# EAGLE design satshakit-M7 (EAGLE 8.4.3)
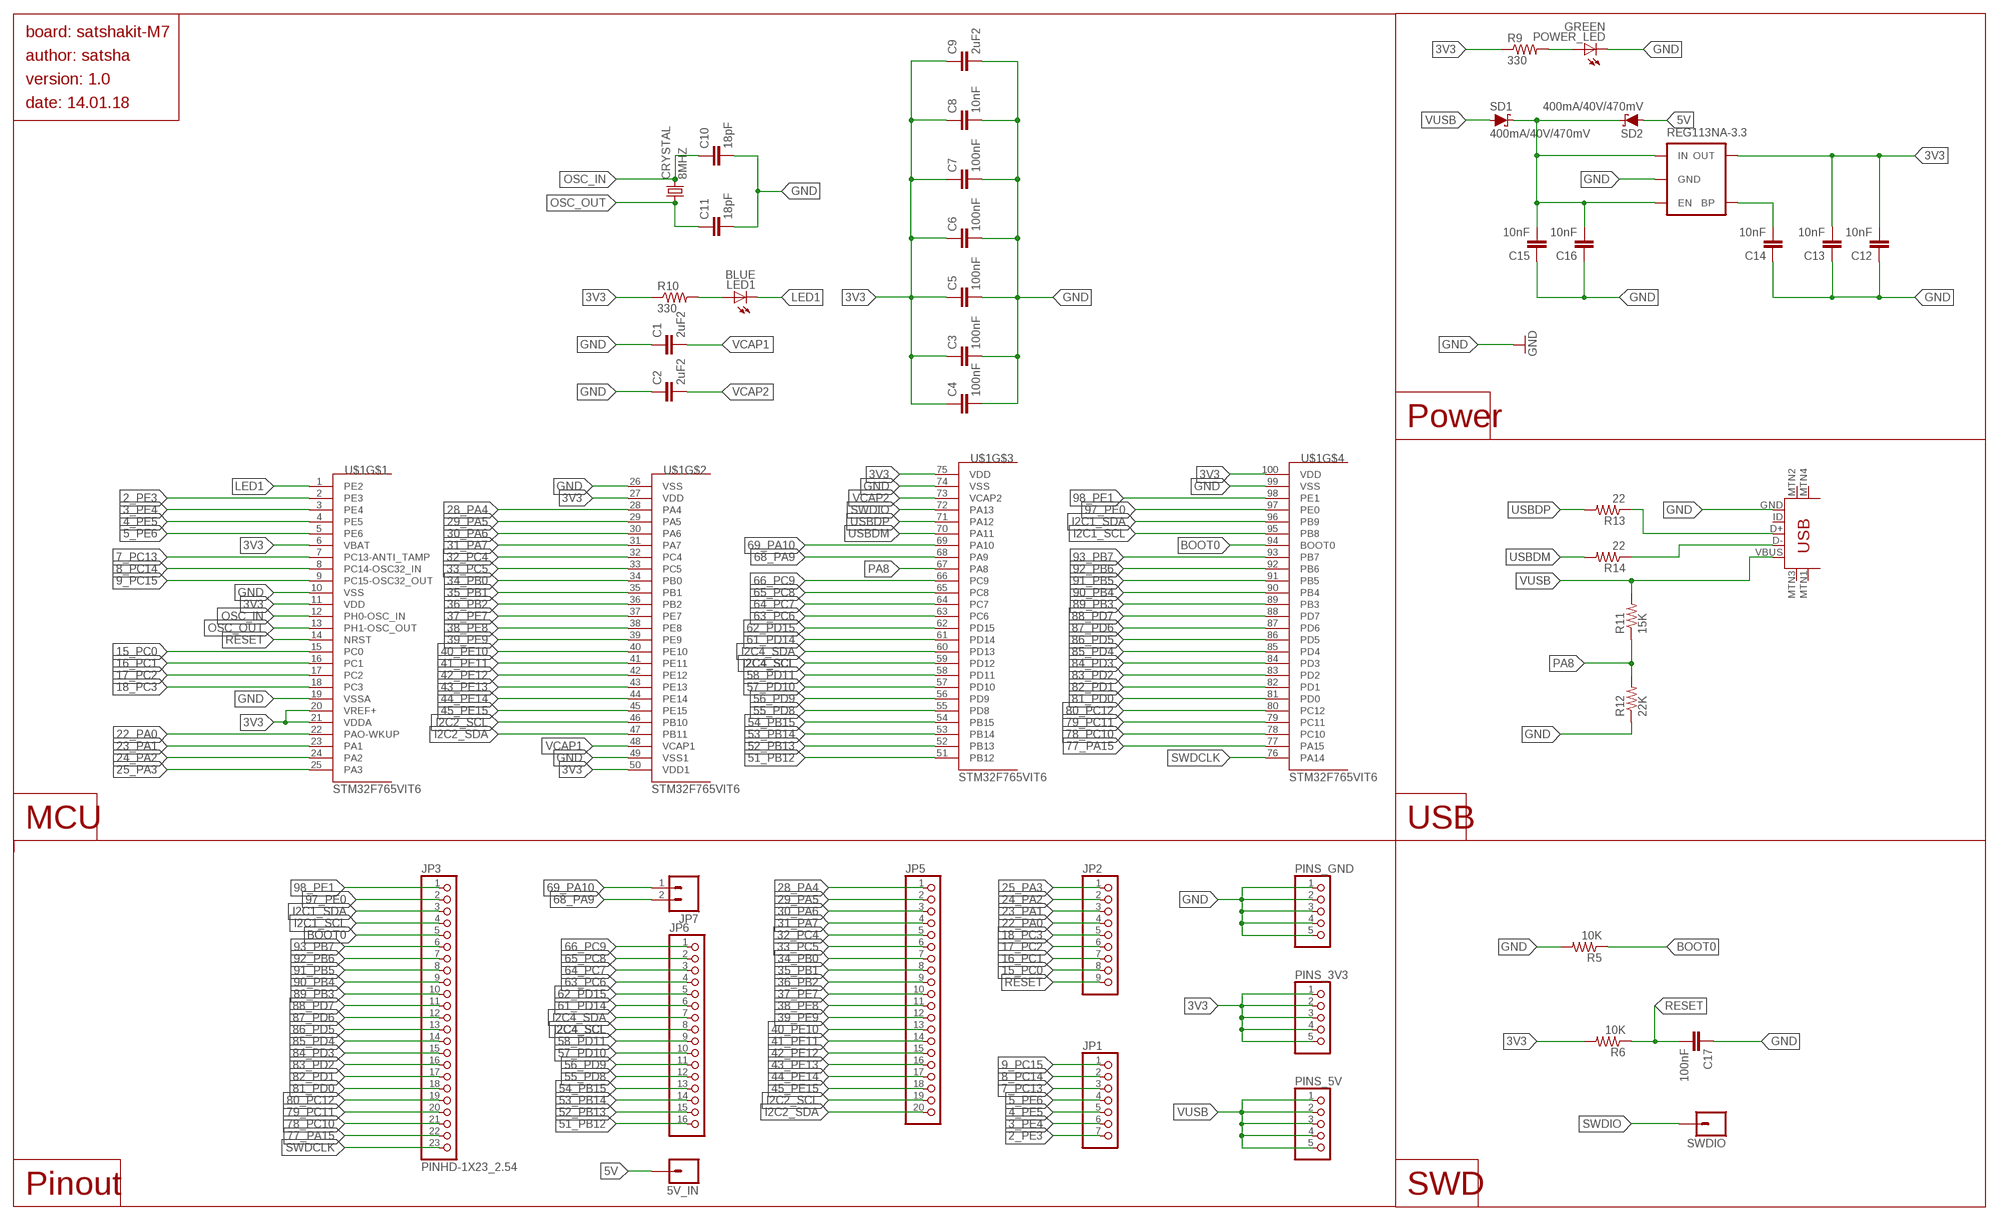
[diagram p0: schematic, sheet 1]

## Parts
5V_IN  M01PTH_LONGPAD  [1X01_LONGPAD]
C1  2uF2  CAP1206  [1206]
C2  2uF2  CAP1206  [1206]
C3  100nF  CAP1206  [1206]
C4  100nF  CAP1206  [1206]
C5  100nF  CAP1206  [1206]
C6  100nF  CAP1206  [1206]
C7  100nF  CAP1206  [1206]
C8  10nF  CAP1206  [1206]
C9  2uF2  CAP1206  [1206]
C10  18pF  CAP1206  [1206]
C11  18pF  CAP1206  [1206]
C12  10nF  CAP1206  [1206]
C13  10nF  CAP1206  [1206]
C14  10nF  CAP1206  [1206]
C15  10nF  CAP1206  [1206]
C16  10nF  CAP1206  [1206]
C17  100nF  CAP1206  [1206]
CRYSTAL  8MHZ  CSM-7X-DU  [CSM-7X-DU]
JP1  PINHD-1X07_2.54  [1X07]
JP2  PINHD-1X09_2.54  [1X09]
JP3  PINHD-1X23_2.54  [1X23]
JP5  PINHD-1X20_2.54  [1X20]
JP6  PINHD-1X16_2.54  [1X16]
JP7  M02  [1X02_LONGPADS]
LED1  BLUE  LED1206  [1206]
PINS_3V3  PINHD-1X05_2.54  [1X05]
PINS_5V  PINHD-1X05_2.54  [1X05]
PINS_GND  PINHD-1X05_2.54  [1X05]
POWER_LED  GREEN  LED1206  [1206]
R5  10K  RESISTOR1206  [1206]
R6  10K  RESISTOR1206  [1206]
R9  330  RESISTOR1206  [1206]
R10  330  RESISTOR1206  [1206]
R11  15K  RESISTOR1206  [1206]
R12  22K  RESISTOR1206  [1206]
R13  22  RESISTOR1206  [1206]
R14  22  RESISTOR1206  [1206]
REG113NA-3.3  V_REG_LDOSMD  [SOT23-5]
SD1  400mA/40V/470mV  DIODE-SCHOTTKY-ZLLS500  [SOT23-3]
SD2  400mA/40V/470mV  DIODE-SCHOTTKY-ZLLS500  [SOT23-3]
SWDIO  M01PTH_LONGPAD  [1X01_LONGPAD]
U$1  STM32F765VIT6  [LQFP100]
U$7  USB-MINIB-5PIN  [USB-MINIB]

## Nets
2_PE3: JP1.7 U$1.2(PE3)
3_PE4: JP1.6 U$1.3(PE4)
3V3: C3.1 C4.1 C5.1 C6.1 C7.1 C8.1 C9.1 C12.2 C13.2 PINS_3V3.1 PINS_3V3.2 PINS_3V3.3 PINS_3V3.4 PINS_3V3.5 R6.2 R9.1 R10.1 REG113NA-3.3.5(OUT) U$1.6(VBAT) U$1.11(VDD) U$1.20(VREF+) U$1.21(VDDA) U$1.27(VDD) U$1.50(VDD1) U$1.75(VDD) U$1.100(VDD)
4_PE5: JP1.5 U$1.4(PE5)
5_PE6: JP1.4 U$1.5(PE6)
5V: 5V_IN.1 SD2.1(A)
7_PC13: JP1.3 U$1.7(PC13-ANTI_TAMP)
8_PC14: JP1.2 U$1.8(PC14-OSC32_IN)
9_PC15: JP1.1 U$1.9(PC15-OSC32_OUT)
15_PC0: JP2.8 U$1.15(PC0)
16_PC1: JP2.7 U$1.16(PC1)
17_PC2: JP2.6 U$1.17(PC2)
18_PC3: JP2.5 U$1.18(PC3)
22_PA0: JP2.4 U$1.22(PAO-WKUP)
23_PA1: JP2.3 U$1.23(PA1)
24_PA2: JP2.2 U$1.24(PA2)
25_PA3: JP2.1 U$1.25(PA3)
28_PA4: JP5.1 U$1.28(PA4)
29_PA5: JP5.2 U$1.29(PA5)
30_PA6: JP5.3 U$1.30(PA6)
31_PA7: JP5.4 U$1.31(PA7)
32_PC4: JP5.5 U$1.32(PC4)
33_PC5: JP5.6 U$1.33(PC5)
34_PB0: JP5.7 U$1.34(PB0)
35_PB1: JP5.8 U$1.35(PB1)
36_PB2: JP5.9 U$1.36(PB2)
37_PE7: JP5.10 U$1.37(PE7)
38_PE8: JP5.11 U$1.38(PE8)
39_PE9: JP5.12 U$1.39(PE9)
40_PE10: JP5.13 U$1.40(PE10)
41_PE11: JP5.14 U$1.41(PE11)
42_PE12: JP5.15 U$1.42(PE12)
43_PE13: JP5.16 U$1.43(PE13)
44_PE14: JP5.17 U$1.44(PE14)
45_PE15: JP5.18 U$1.45(PE15)
51_PB12: JP6.16 U$1.51(PB12)
52_PB13: JP6.15 U$1.52(PB13)
53_PB14: JP6.14 U$1.53(PB14)
54_PB15: JP6.13 U$1.54(PB15)
55_PD8: JP6.12 U$1.55(PD8)
56_PD9: JP6.11 U$1.56(PD9)
57_PD10: JP6.10 U$1.57(PD10)
58_PD11: JP6.9 U$1.58(PD11)
61_PD14: JP6.6 U$1.61(PD14)
62_PD15: JP6.5 U$1.62(PD15)
63_PC6: JP6.4 U$1.63(PC6)
64_PC7: JP6.3 U$1.64(PC7)
65_PC8: JP6.2 U$1.65(PC8)
66_PC9: JP6.1 U$1.66(PC9)
68_PA9: JP7.2 U$1.68(PA9)
69_PA10: JP7.1 U$1.69(PA10)
77_PA15: JP3.22 U$1.77(PA15)
78_PC10: JP3.21 U$1.78(PC10)
79_PC11: JP3.20 U$1.79(PC11)
80_PC12: JP3.19 U$1.80(PC12)
81_PD0: JP3.18 U$1.81(PD0)
82_PD1: JP3.17 U$1.82(PD1)
83_PD2: JP3.16 U$1.83(PD2)
84_PD3: JP3.15 U$1.84(PD3)
85_PD4: JP3.14 U$1.85(PD4)
86_PD5: JP3.13 U$1.86(PD5)
87_PD6: JP3.12 U$1.87(PD6)
88_PD7: JP3.11 U$1.88(PD7)
89_PB3: JP3.10 U$1.89(PB3)
90_PB4: JP3.9 U$1.90(PB4)
91_PB5: JP3.8 U$1.91(PB5)
92_PB6: JP3.7 U$1.92(PB6)
93_PB7: JP3.6 U$1.93(PB7)
97_PE0: JP3.2 U$1.97(PE0)
98_PE1: JP3.1 U$1.98(PE1)
BOOT0: JP3.5 R5.1 U$1.94(BOOT0)
GND: C1.1 C2.1 C3.2 C4.2 C5.2 C6.2 C7.2 C8.2 C9.2 C10.2 C11.2 C12.1 C13.1 C14.1 C15.1 C16.1 C17.1 PINS_GND.1 PINS_GND.2 PINS_GND.3 PINS_GND.4 PINS_GND.5 POWER_LED.2(C) R5.2 R12.1 REG113NA-3.3.2(GND) U$1.10(VSS) U$1.19(VSSA) U$1.26(VSS) U$1.49(VSS1) U$1.74(VSS) U$1.99(VSS) U$7.GND
I2C1_SCL: JP3.4 U$1.95(PB8)
I2C1_SDA: JP3.3 U$1.96(PB9)
I2C2_SCL: JP5.19 U$1.46(PB10)
I2C2_SDA: JP5.20 U$1.47(PB11)
I2C4_SCL: JP6.8 U$1.59(PD12)
I2C4_SDA: JP6.7 U$1.60(PD13)
LED1: LED1.2(C) U$1.1(PE2)
N$1: POWER_LED.1(A) R9.2
N$2: LED1.1(A) R10.2
N$3: C15.2 C16.2 REG113NA-3.3.1(IN) REG113NA-3.3.3(EN) SD1.3(C) SD2.3(C)
N$5: R14.1 U$7.D-
N$6: R13.1 U$7.D+
NR: C14.2 REG113NA-3.3.4(BP)
OSC_IN: C10.1 CRYSTAL.2 U$1.12(PH0-OSC_IN)
OSC_OUT: C11.1 CRYSTAL.1 U$1.13(PH1-OSC_OUT)
PA8: R11.1 R12.2 U$1.67(PA8)
RESET: C17.2 JP2.9 R6.1 U$1.14(NRST)
SWDCLK: JP3.23 U$1.76(PA14)
SWDIO: SWDIO.1 U$1.72(PA13)
USBDM: R14.2 U$1.70(PA11)
USBDP: R13.2 U$1.71(PA12)
VCAP1: C1.2 U$1.48(VCAP1)
VCAP2: C2.2 U$1.73(VCAP2)
VUSB: PINS_5V.1 PINS_5V.2 PINS_5V.3 PINS_5V.4 PINS_5V.5 R11.2 SD1.1(A) U$7.VBUS
Unconnected: U$7.ID U$7.MTN1(MTN2) U$7.MTN2(MTN3) U$7.MTN3(MTN1) U$7.MTN4

## Notes on the sheet
- board: satshakit-M7
- author: satsha
- version: 1.0
- date: 14.01.18
- Power
- MCU | USB
- Pinout | SWD

## Library data of the parts
5V_IN SWDIO = flight_controller.lbr01_SparkFun:M01: Header 1 Standard 1-pin 0.1" header. Use with straight break away headers (SKU : PRT-00116), right angle break away headers (PRT-00553), swiss pins (PRT-00743), machine pins (PRT-00117), and female headers (PRT-00115).
C1-C17 = 01_SparkFun:CAP: Capacitor Standard 0603 ceramic capacitor, and 0.1" leaded capacitor.
CRYSTAL = flight_controller.lbr01_FAB_Hello:CSM-7X-DU: SMD CRYSTAL Source: www.ecsxtal.com .. Crystal 3.6864MHz CSM_7X_DU.PDF; OC_FARNELL: unknown; OC_NEWARK: unknown
JP1 = pinhead-2:PINHD-1X07: PIN HEADER
JP2 = pinhead-2:PINHD-1X09: PIN HEADER
JP3 = pinhead-2:PINHD-1X23: PIN HEADER
JP5 = pinhead-2:PINHD-1X20: PIN HEADER
JP6 = pinhead-2:PINHD-1X16: PIN HEADER
JP7 = flight_controller.lbr01_SparkFun:M02: Header 2 Standard 2-pin 0.1" header. Use with straight break away headers (SKU : PRT-00116), right angle break away headers (PRT-00553), swiss pins (PRT-00743), machine pins (PRT-00117), and female headers (PRT-00115). Molex polarized connector foot print use with SKU : PRT-08233 with associated crimp pins and housings.
LED1 POWER_LED = flight_controller.lbr01_FAB_Hello:LED
PINS_3V3 PINS_5V PINS_GND = pinhead-2:PINHD-1X05: PIN HEADER
R5 R6 R9-R14 = flight_controller.lbr01_SparkFun:RESISTOR: Resistor Basic schematic elements and footprints for 0603, 1206, and PTH 1/10th watt (small) resistors.
REG113NA-3.3 = 01_SparkFun:V_REG_LDO: Voltage Regulator LDO Standard 150mA LDO voltage regulator in SOT-23 layout. Micrel part MIC5205. BP (by-pass) pin is used to lower output noise with 470pF cap.
SD1 SD2 = SparkFun-DiscreteSemi:DIODE-SCHOTTKY: Schottky diode A Schottky diode is a semiconductor diode which has a low forward voltage drop and a very fast switching action.; PROD_ID: DIO-08411; VALUE: 700mA/40V/533mV
U$1 = STM32F765VIT6:STM32F765VIT6: STmicroelectronics Cortex M4 Series Typ: STM32F407Vx LQFP100 Copyright 2012 by Ersan Günes, Quantitec, info@quantitec.de
U$7 = SparkFun:USB-MINIB

## Board
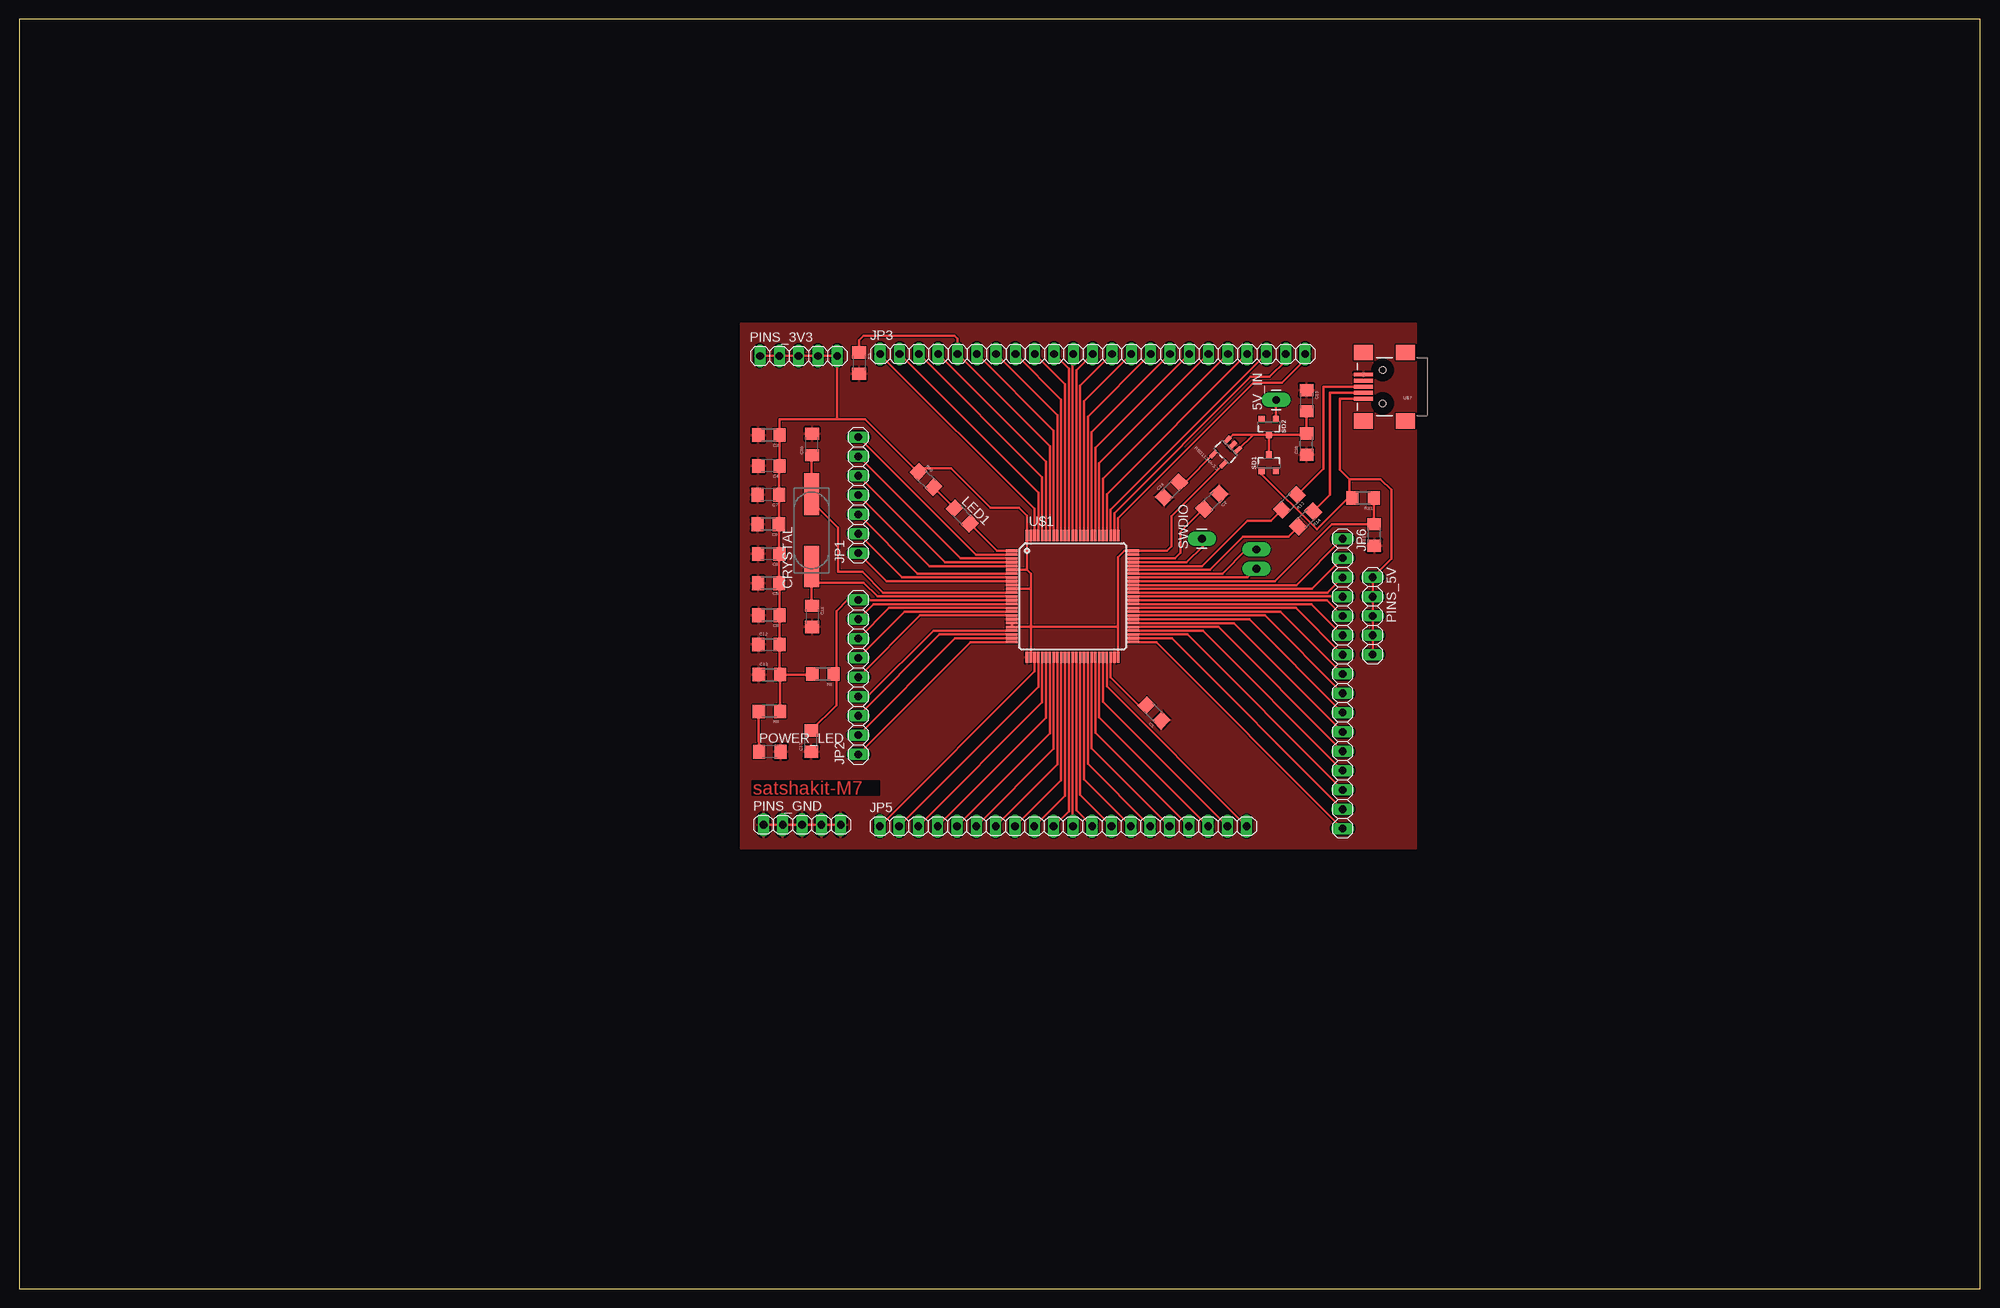
[diagram p1: board, top side]

Size 258 x 167 mm. Coordinates in mm from the lower left corner, seen from the top.
Outline: 0,0 258,0 258,167 0,167 0,0
Copper layers (1*16): Top 0.035mm / dielectric 1.5mm / Bottom 0.035mm
Design rules "default": minimum track width 6mil, minimum drill 0.35mm, track to track 6mil, track to pad 6mil, pad to pad 6mil, via to via 6mil, smd to smd 6mil, copper to edge 40mil, drill to drill 6mil, minimum pad ring 10mil, minimum via ring 8mil, stop-mask expansion 4mil, vias tented up to drill 0mil, thermal gap 10mil

### Footprints (pad centres in the part's own frame; a part is rotated, then mirrored left to right if it is on the bottom)
1X01_LONGPAD = drill 1.016 pad 1.88 long: 1 0,0
1206 = smd 1.6 x 1.8: 1 -1.4,0; 2 1.4,0
CSM-7X-DU = smd 5.5 x 2: 1 -4.75,0; 2 4.75,0
1X07 = drill 1.016 long: 1 -7.62,0; 2 -5.08,0; 3 -2.54,0; 4 0,0; 5 2.54,0; 6 5.08,0; 7 7.62,0
1X09 = drill 1.016 long: 1 -10.16,0; 2 -7.62,0; 3 -5.08,0; 4 -2.54,0; 5 0,0; 6 2.54,0; 7 5.08,0; 8 7.62,0; 9 10.16,0
1X23 = drill 1.016 long: 1 -26.67,0; 2 -24.13,0; 3 -21.59,0; 4 -19.05,0; 5 -16.51,0; 6 -13.97,0; 7 -11.43,0; 8 -8.89,0; 9 -6.35,0; 10 -3.81,0; 11 -1.27,0; 12 1.27,0; 13 3.81,0; 14 6.35,0; 15 8.89,0; 16 11.43,0; 17 13.97,0; 18 16.51,0; 19 19.05,0; 20 21.59,0; 21 24.13,0; 22 26.67,0; 23 29.21,0
1X20 = drill 1.016 long: 1 -24.13,0; 2 -21.59,0; 3 -19.05,0; 4 -16.51,0; 5 -13.97,0; 6 -11.43,0; 7 -8.89,0; 8 -6.35,0; 9 -3.81,0; 10 -1.27,0; 11 1.27,0; 12 3.81,0; 13 6.35,0; 14 8.89,0; 15 11.43,0; 16 13.97,0; 17 16.51,0; 18 19.05,0; 19 21.59,0; 20 24.13,0
1X16 = drill 1.016 long: 1 -19.05,0; 2 -16.51,0; 3 -13.97,0; 4 -11.43,0; 5 -8.89,0; 6 -6.35,0; 7 -3.81,0; 8 -1.27,0; 9 1.27,0; 10 3.81,0; 11 6.35,0; 12 8.89,0; 13 11.43,0; 14 13.97,0; 15 16.51,0; 16 19.05,0
1X02_LONGPADS = drill 1.016 pad 1.88 long: 1 0,0; 2 2.54,0
1206' = smd 1.6 x 1.803: 1 -1.422,0; 2 1.422,0
1X05 = drill 1.016 long: 1 -5.08,0; 2 -2.54,0; 3 0,0; 4 2.54,0; 5 5.08,0
SOT23-5 = smd 0.55 x 1.2: 1 -0.95,-1.3; 2 0,-1.3; 3 0.95,-1.3; 4 0.95,1.3; 5 -0.95,1.3
SOT23-3 = smd 0.8 x 0.9: 1 -0.95,-1; 2 0.95,-1; 3 0,1.1
LQFP100 = smd 1.5 x 0.35: 1 -8,6; 2 -8,5.5; 3 -8,5; 4 -8,4.5; 5 -8,4; 6 -8,3.5; 7 -8,3; 8 -8,2.5; 9 -8,2; 10 -8,1.5; 11 -8,1; 12 -8,0.5; 13 -8,0; 14 -8,-0.5; 15 -8,-1; 16 -8,-1.5; 17 -8,-2; 18 -8,-2.5; 19 -8,-3; 20 -8,-3.5; 21 -8,-4; 22 -8,-4.5; 23 -8,-5; 24 -8,-5.5; 25 -8,-6; 51 8,-6; 52 8,-5.5; 53 8,-5; 54 8,-4.5; 55 8,-4; 56 8,-3.5; 57 8,-3; 58 8,-2.5; 59 8,-2; 60 8,-1.5; 61 8,-1; 62 8,-0.5; 63 8,0; 64 8,0.5; 65 8,1; 66 8,1.5; 67 8,2; 68 8,2.5; 69 8,3; 70 8,3.5; 71 8,4; 72 8,4.5; 73 8,5; 74 8,5.5; 75 8,6 | smd 0.35 x 1.5: 26 -6,-8; 27 -5.5,-8; 28 -5,-8; 29 -4.5,-8; 30 -4,-8; 31 -3.5,-8; 32 -3,-8; 33 -2.5,-8; 34 -2,-8; 35 -1.5,-8; 36 -1,-8; 37 -0.5,-8; 38 0,-8; 39 0.5,-8; 40 1,-8; 41 1.5,-8; 42 2,-8; 43 2.5,-8; 44 3,-8; 45 3.5,-8; 46 4,-8; 47 4.5,-8; 48 5,-8; 49 5.5,-8; 50 6,-8; 76 6,8; 77 5.5,8; 78 5,8; 79 4.5,8; 80 4,8; 81 3.5,8; 82 3,8; 83 2.5,8; 84 2,8; 85 1.5,8; 86 1,8; 87 0.5,8; 88 0,8; 89 -0.5,8; 90 -1,8; 91 -1.5,8; 92 -2,8; 93 -2.5,8; 94 -3,8; 95 -3.5,8; 96 -4,8; 97 -4.5,8; 98 -5,8; 99 -5.5,8; 100 -6,8
USB-MINIB = smd 2.5 x 0.5: D+ 2.5,0; D- 2.5,0.8; GND 2.5,-1.6; ID 2.5,-0.8; VBUS 2.5,1.6 | smd 2.5 x 2: MTN1 -3,4.5; MTN2 2.5,4.5; MTN3 -3,-4.5; MTN4 2.5,-4.5 | hole 0.9: 0,2.2; 0,-2.2

### Placement (x,y rotation side)
5V_IN  165.35,116.9 90 top
C1  149.28,75.76 135 top
C2  156.89,103.56 225 top
C3  98.64,112.29 180 top
C4  98.64,108.23 180 top
C5  98.59,92.8 180 top
C6  98.54,100.57 180 top
C7  98.55,104.45 180 top
C8  98.65,88.6 180 top
C9  98.6,96.65 180 top
C10  104.3,111.05 90 top
C11  104.3,88.45 270 top
C12  98.65,84.75 0 top
C13  98.7,80.8 0 top
C14  151.6,105.1 45 top
C15  169.35,116.8 270 top
C16  169.35,111.1 90 top
C17  104.2,72.05 90 top
CRYSTAL  104.25,99.75 90 top
JP1  110.4,104.4 90 top
JP2  110.4,80.45 90 top
JP3  139.95,122.95 0 top
JP5  137.35,60.85 0 top
JP6  174.1,79.6 270 top
JP7  162.75,97.25 270 top
LED1  BLUE  [1206']  124.05,101.65 315 top
PINS_3V3  102.55,122.7 0 top
PINS_5V  178.05,88.5 270 top
PINS_GND  103,61.05 0 top
POWER_LED  GREEN  [1206']  98.75,70.65 0 top
R5  110.5,121.75 270 top
R6  105.75,80.85 180 top
R9  98.7,75.95 180 top
R10  119.3,106.45 315 top
R11  176.8,104 180 top
R12  178.25,99.15 90 top
R13  167.1,103.45 225 top
R14  169.25,101.25 225 top
REG113NA-3.3  158.7,110.05 135 top
SD1  164.4,108.6 0 top
SD2  164.4,113.4 180 top
SWDIO  155.6,98.65 90 top
U$1  138.58,91.07 0 top
U$7  179.35,118.65 180 top

### Tracks (layer width: path | path; a pad name or v marks a point on that pad's centre or on a via)
2_PE3
  Top 0.305: U$1.2 125.85,96.57 JP1.7
3_PE4
  Top 0.305: U$1.3 123.81,96.07 JP1.6
3V3
  Top 0.305: U$1.50 144.58,87.07 144.55,87.07 | 133.08,87.07 U$1.21 U$1.20 | 133.1,87.07 133.08,87.07 | 133.08,87.07 U$1.27 | 133.1,92.07 U$1.11 | 133.1,92.07 133.1,87.07 | 144.55,87.07 133.1,87.07 | 133.1,92.07 133.1,94.05 132.58,94.57 | 132.58,94.57 U$1.6 | 132.58,94.57 U$1.100 132.58,101.67 131.55,102.7 127.8,102.7 122.6,107.9 118.31,107.9 R10.1 118.2,107.44 118.2,107.45 111.3,114.35 107.7,114.35 | 100.04,108.35 C4.1 | 100.04,108.35 C3.1 100.04,114.34 | 100.04,108.35 99.95,108.35 C7.1 C6.1 99.94,96.95 C9.1 C5.1 100.05,92.8 C8.1 C12.2 100.05,80.8 C13.2 | C13.2 R9.1 | 100.04,114.34 100.05,114.35 100.1,114.3 | 100.04,114.34 100.03,114.35 107.7,114.35 | C13.2 104.3,80.8 R6.2 | 144.55,87.07 144.55,96.2 145.42,97.07 U$1.75 151.02,97.07 151.6,97.65 151.6,101.61 REG113NA-3.3.5 | PINS_3V3.2 100.05,122.7 100.05,122.5 | PINS_3V3.1 PINS_3V3.2 | PINS_3V3.2 PINS_3V3.3 PINS_3V3.4 PINS_3V3.5 107.63,114.35 107.7,114.35
4_PE5
  Top 0.305: U$1.4 121.77,95.57 JP1.5
5_PE6
  Top 0.305: U$1.5 119.73,95.07 JP1.4
5V
  Top 0.305: 5V_IN.1 SD2.1
7_PC13
  Top 0.305: U$1.7 118.19,94.07 JP1.3
8_PC14
  Top 0.305: U$1.8 116.15,93.57 JP1.2
9_PC15
  Top 0.305: U$1.9 114.11,93.07 JP1.1
15_PC0
  Top 0.305: U$1.15 130.56,90.05 112.38,90.05 JP2.8
16_PC1
  Top 0.305: U$1.16 114.44,89.57 JP2.7
17_PC2
  Top 0.305: U$1.17 116.48,89.07 JP2.6
18_PC3
  Top 0.305: U$1.18 118.52,88.57 JP2.5
22_PA0
  Top 0.305: U$1.22 120.27,86.57 111.7,78 110.49,78 JP2.4
23_PA1
  Top 0.305: U$1.23 121.1,86.07 JP2.3
24_PA2
  Top 0.305: U$1.24 123.14,85.57 JP2.2
25_PA3
  Top 0.305: U$1.25 125.18,85.07 JP2.1
28_PA4
  Top 0.305: U$1.28 133.58,81.21 JP5.1
29_PA5
  Top 0.305: U$1.29 134.08,79.17 JP5.2
30_PA6
  Top 0.305: U$1.30 134.58,77.13 JP5.3
31_PA7
  Top 0.305: U$1.31 135.08,75.09 JP5.4
32_PC4
  Top 0.305: U$1.32 135.58,73.05 JP5.5
33_PC5
  Top 0.305: U$1.33 136.08,71.01 JP5.6
34_PB0
  Top 0.305: U$1.34 136.58,68.97 JP5.7
35_PB1
  Top 0.305: U$1.35 137.08,66.93 JP5.8
36_PB2
  Top 0.305: U$1.36 137.58,64.89 JP5.9
37_PE7
  Top 0.305: U$1.37 138.08,62.85 JP5.10
38_PE8
  Top 0.305: U$1.38 138.58,60.89 JP5.11
39_PE9
  Top 0.305: U$1.39 139.08,62.93 JP5.12
40_PE10
  Top 0.305: U$1.40 139.58,64.97 JP5.13
41_PE11
  Top 0.305: U$1.41 140.08,67.01 JP5.14
42_PE12
  Top 0.305: U$1.42 140.58,69.05 JP5.15
43_PE13
  Top 0.305: U$1.43 141.08,71.09 JP5.16
44_PE14
  Top 0.305: U$1.44 141.58,73.13 JP5.17
45_PE15
  Top 0.305: U$1.45 142.08,75.17 JP5.18
51_PB12
  Top 0.305: U$1.51 149.58,85.07 JP6.16
52_PB13
  Top 0.305: U$1.52 151.62,85.57 JP6.15
53_PB14
  Top 0.305: U$1.53 153.66,86.07 JP6.14
54_PB15
  Top 0.305: U$1.54 155.7,86.57 JP6.13
55_PD8
  Top 0.305: U$1.55 157.74,87.07 JP6.12
56_PD9
  Top 0.305: U$1.56 159.78,87.57 JP6.11
57_PD10
  Top 0.305: U$1.57 161.82,88.07 JP6.10
58_PD11
  Top 0.305: U$1.58 163.86,88.57 JP6.9
61_PD14
  Top 0.305: U$1.61 169.98,90.07 JP6.6
62_PD15
  Top 0.305: U$1.62 172.02,90.57 JP6.5
63_PC6
  Top 0.305: U$1.63 174.06,91.07 JP6.4
64_PC7
  Top 0.305: U$1.64 172.1,91.57 JP6.3
65_PC8
  Top 0.305: U$1.65 170.06,92.07 JP6.2
66_PC9
  Top 0.305: U$1.66 168.02,92.57 JP6.1
68_PA9
  Top 0.305: U$1.68 161.61,93.57 JP7.2
69_PA10
  Top 0.305: U$1.69 158.27,94.07 161.45,97.25 JP7.1
77_PA15
  Top 0.305: JP3.22 166.62,122.07 164.5,119.95 162,119.95 144.08,102.03 U$1.77
78_PC10
  Top 0.305: U$1.78 143.58,102.45 JP3.21
79_PC11
  Top 0.305: U$1.79 143.08,104.49 JP3.20
80_PC12
  Top 0.305: U$1.80 142.58,106.53 JP3.19
81_PD0
  Top 0.305: U$1.81 142.08,108.57 JP3.18
82_PD1
  Top 0.305: U$1.82 141.58,110.61 JP3.17
83_PD2
  Top 0.305: U$1.83 141.08,112.65 JP3.16
84_PD3
  Top 0.305: U$1.84 140.58,114.69 JP3.15
85_PD4
  Top 0.305: U$1.85 140.08,116.73 JP3.14
86_PD5
  Top 0.305: U$1.86 139.58,118.77 JP3.13
87_PD6
  Top 0.305: U$1.87 139.08,120.81 JP3.12
88_PD7
  Top 0.305: U$1.88 138.58,122.85 JP3.11
89_PB3
  Top 0.305: U$1.89 138.08,121.01 JP3.10
90_PB4
  Top 0.305: U$1.90 137.58,118.97 JP3.9
91_PB5
  Top 0.305: U$1.91 137.08,116.93 JP3.8
92_PB6
  Top 0.305: U$1.92 136.58,114.89 JP3.7
93_PB7
  Top 0.305: U$1.93 136.08,112.85 JP3.6
97_PE0
  Top 0.305: U$1.97 134.08,104.69 JP3.2
98_PE1
  Top 0.305: U$1.98 133.58,102.57 113.28,122.87 JP3.1
BOOT0
  Top 0.305: 135.6,99.09 U$1.94 135.58,110.81 JP3.5 123.44,124.96 123.05,125.35 111.1,125.35 110.5,124.75 R5.1
GND
  Top 0.305: PINS_GND.5 PINS_GND.4 PINS_GND.3 PINS_GND.2 PINS_GND.1
  pour Top (isolate 0.15): 95,126.95 95,57.95 183.75,57.95 183.75,126.95
I2C1_SCL
  Top 0.305: U$1.95 135.08,108.77 JP3.4
I2C1_SDA
  Top 0.305: U$1.96 134.58,106.73 JP3.3
I2C2_SCL
  Top 0.305: U$1.46 142.58,77.21 JP5.19
I2C2_SDA
  Top 0.305: U$1.47 143.08,79.25 JP5.20
I2C4_SCL
  Top 0.305: U$1.59 165.9,89.07 JP6.8
I2C4_SDA
  Top 0.305: U$1.60 167.94,89.57 JP6.7
LED1
  Top 0.305: U$1.1 128.63,97.07 LED1.2
N$1
  Top 0.305: R9.2 97.3,73.15 POWER_LED.1
N$2
  Top 0.305: LED1.1 120.29,105.41 R10.2
N$3
  Top 0.305: REG113NA-3.3.1 162.34,112.35 | 162.34,112.35 159.66,112.35 REG113NA-3.3.3 | 162.34,112.35 164.35,112.35 SD2.3 | SD1.3 SD2.3 | 167.55,112.3 167.7,112.3 | 167.55,112.3 SD2.3 | C15.2 C16.2 169.15,112.3 167.55,112.3
N$5
  Top 0.305: 170.49,102.24 R14.1 172.45,104.45 172.45,117.85 U$7.D-
N$6
  Top 0.305: 171.55,109.25 171.55,109 | 171.55,109 171.55,107.85 168.14,104.44 R13.1 | 171.55,109 171.55,118.65 U$7.D+
NR
  Top 0.305: REG113NA-3.3.4 153.4,106.09 C14.2
OSC_IN
  Top 0.305: U$1.12 113.68,91.57 110.95,94.3 107.75,94.3 107.75,100.1 104.25,103.6 CRYSTAL.2 104.25,109.6 C10.1
OSC_OUT
  Top 0.305: U$1.13 112.93,91.07 111.1,92.9 104.35,92.9 104.35,92.95 104.25,92.95 CRYSTAL.1 104.25,89.9 C11.1
PA8
  Top 0.305: U$1.67 165.22,93.07 172.7,100.55 178.15,100.55 | 178.15,100.55 R12.2 | R11.1 178.2,100.6 178.15,100.55
RESET
  Top 0.305: U$1.14 110.44,90.57 JP2.9 108.96,90.61 107.5,89.15 107.5,81.2 107.42,81.12 | C17.2 107.5,76.75 107.5,81.05 107.42,81.12 | 107.42,81.12 R6.1
SWDCLK
  Top 0.305: U$1.76 144.58,101.38 162.35,119.15 166.1,119.15 169.16,122.21 JP3.23
SWDIO
  Top 0.305: U$1.72 153.57,95.57 155.7,97.7 155.7,98.55 SWDIO.1
USBDM
  Top 0.305: U$1.70 156.62,94.57 161,98.95 166.95,98.95 R14.2
USBDP
  Top 0.305: U$1.71 155.62,95.07 161.6,101.05 164.7,101.05 R13.2
VCAP1
  Top 0.305: U$1.48 143.58,80.42 147.75,76.25 147.8,76.25 C1.2
VCAP2
  Top 0.305: U$1.73 152.07,96.07 152.8,96.8 152.8,99.6 155.77,102.57 C2.2
VUSB
  Top 0.305: 175,104 R11.2 | 175,104 174.8,104 170.7,99.9 163.45,107.15 SD1.1 | 175,106.5 175,104 | PINS_5V.5 PINS_5V.4 PINS_5V.3 PINS_5V.2 PINS_5V.1 180.5,96.03 180.5,105.1 179.1,106.5 175,106.5 | U$7.VBUS 173.75,117.05 173.75,107.75 175,106.5

### Text on the board
Top: satshakit-M7